# EAGLE design AVR_2x16_LCD_debug_ATmega48_board1 (EAGLE 6.5.0)
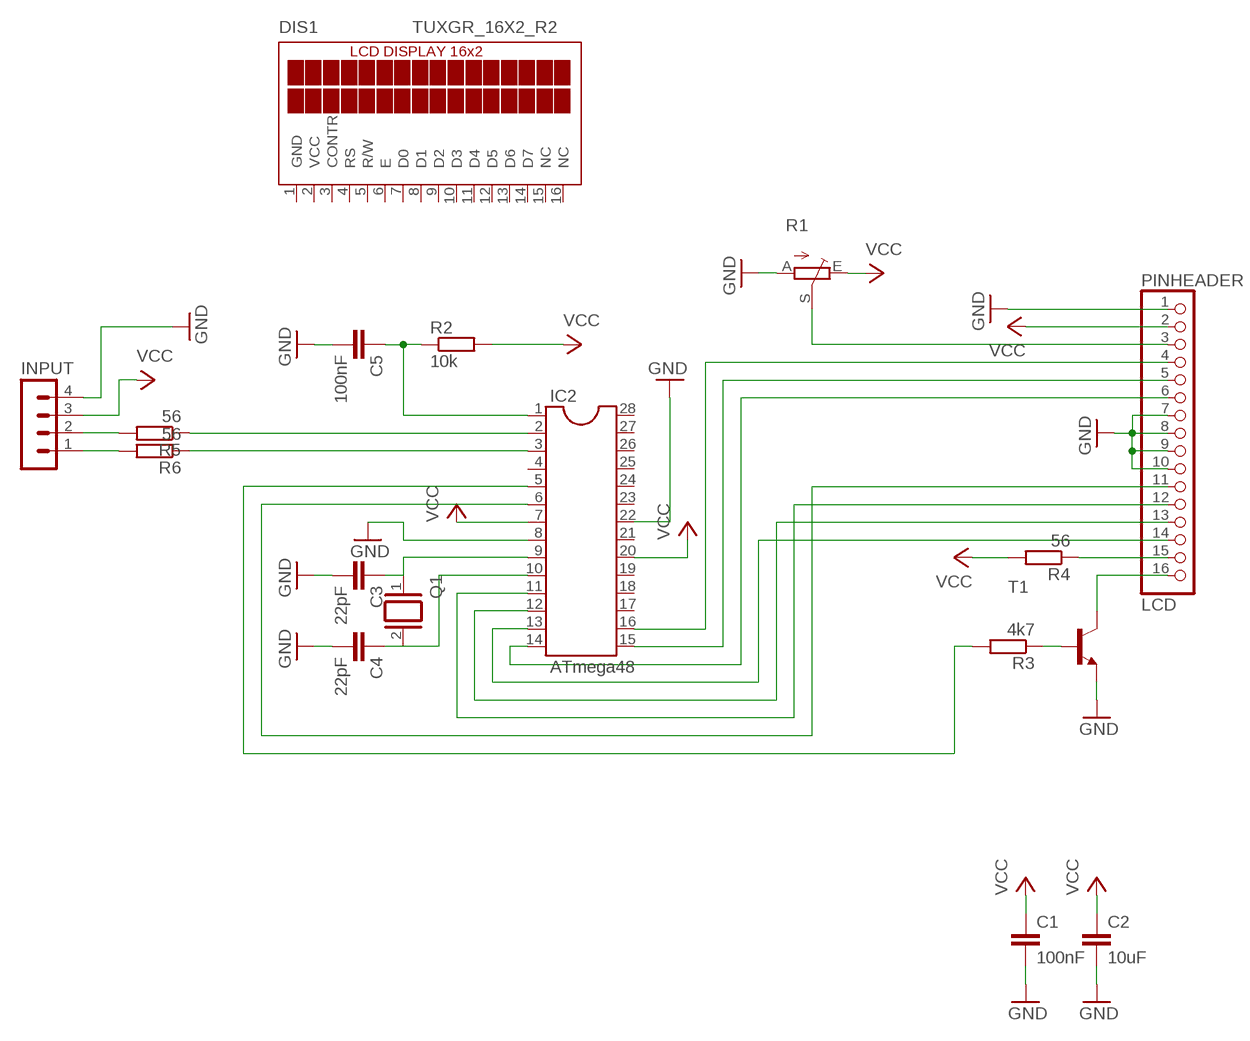
[diagram p0: schematic, sheet 1]

## Parts
C1  100nF  C5/2.5  [C5B2.5]
C2  10uF  C5/2.5  [C5B2.5]
C3  22pF  C5/2.5  [C5B2.5]
C4  22pF  C5/2.5  [C5B2.5]
C5  100nF  C5/2.5  [C5B2.5]
DIS1  TUXGR_16X2_R2  [TUXGR_16X2_R2]
IC2  ATmega48  DIL28-3  [DIL28-3]
INPUT  MA04-1  [MA04-1]
PINHEADER  LCD  PINHD-1X16  [1X16]
Q1  XTAL  [Q]
R1  TRIM_EU-CA6V  [CA6V]
R2  10k  R-EU_0204/5  [0204/5]
R3  4k7  R-EU_0204/5  [0204/5]
R4  56  R-EU_0204/5  [0204/5]
R5  56  R-EU_0204/5  [0204/5]
R6  56  R-EU_0204/5  [0204/5]
T1  -NPN-TO92  [TO92]

## Nets
GND: C1.2 C2.2 C3.2 C4.2 C5.2 IC2.8 IC2.22 INPUT.4 PINHEADER.1 PINHEADER.7 PINHEADER.8 PINHEADER.9 PINHEADER.10 R1.A T1.1(E)
N$1: PINHEADER.3 R1.S
N$2: C3.1 IC2.9 Q1.1
N$3: C4.1 IC2.10 Q1.2
N$4: IC2.2 R5.1
N$5: IC2.5 R3.2
N$6: IC2.3 R6.1
N$7: R3.1 T1.2(B)
N$8: PINHEADER.16 T1.3(C)
N$9: PINHEADER.15 R4.1
N$10: IC2.16 PINHEADER.4
N$11: IC2.15 PINHEADER.5
N$12: IC2.14 PINHEADER.6
N$13: IC2.13 PINHEADER.14
N$14: IC2.12 PINHEADER.13
N$15: IC2.11 PINHEADER.12
N$16: IC2.6 PINHEADER.11
RESET: C5.1 IC2.1 R2.1
RX: INPUT.2 R5.2
TX: INPUT.1 R6.2
VCC: C1.1 C2.1 IC2.7 IC2.20 INPUT.3 PINHEADER.2 R1.E R2.2 R4.2
Unconnected: DIS1.3(CONTR) DIS1.4(RS) DIS1.5(R/W) DIS1.6(E) DIS1.7(D0) DIS1.8(D1) DIS1.9(D2) DIS1.10(D3) DIS1.11(D4) DIS1.12(D5) DIS1.13(D6) DIS1.14(D7) DIS1.15(NC) DIS1.16(NC) IC2.4 IC2.17 IC2.18 IC2.19 IC2.21 IC2.23 IC2.24 IC2.25 IC2.26 IC2.27 IC2.28

## Power pins joined to a net without a drawn wire
GND: DIS1.1(GND)
VCC: DIS1.2(VCC)

## Library data of the parts
C1-C5 = capacitor-wima:C: CAPACITOR naming: grid - package width
DIS1 = display-lcd:TUXGR_16X2_R2: Tuxgraphics LCD display 16x2 characters reflective, without background light Source: tuxgr_12x2_r2.pdf; OC_FARNELL: unknown; OC_NEWARK: unknown
IC2 = ic-package:DIL28: Dual In Line
INPUT = con-lstb:MA04-1: PIN HEADER; OC_FARNELL: unknown; OC_NEWARK: unknown
PINHEADER = pinhead:PINHD-1X16: PIN HEADER
Q1 = special:XTAL: CRYSTAL
R1 = pot:TRIM_EU-: POTENTIOMETER
R2-R6 = rcl:R-EU_: RESISTOR, European symbol
T1 = transistor:*-NPN-: NPN Transistror BF959 corrected 2008.03.06

## Board
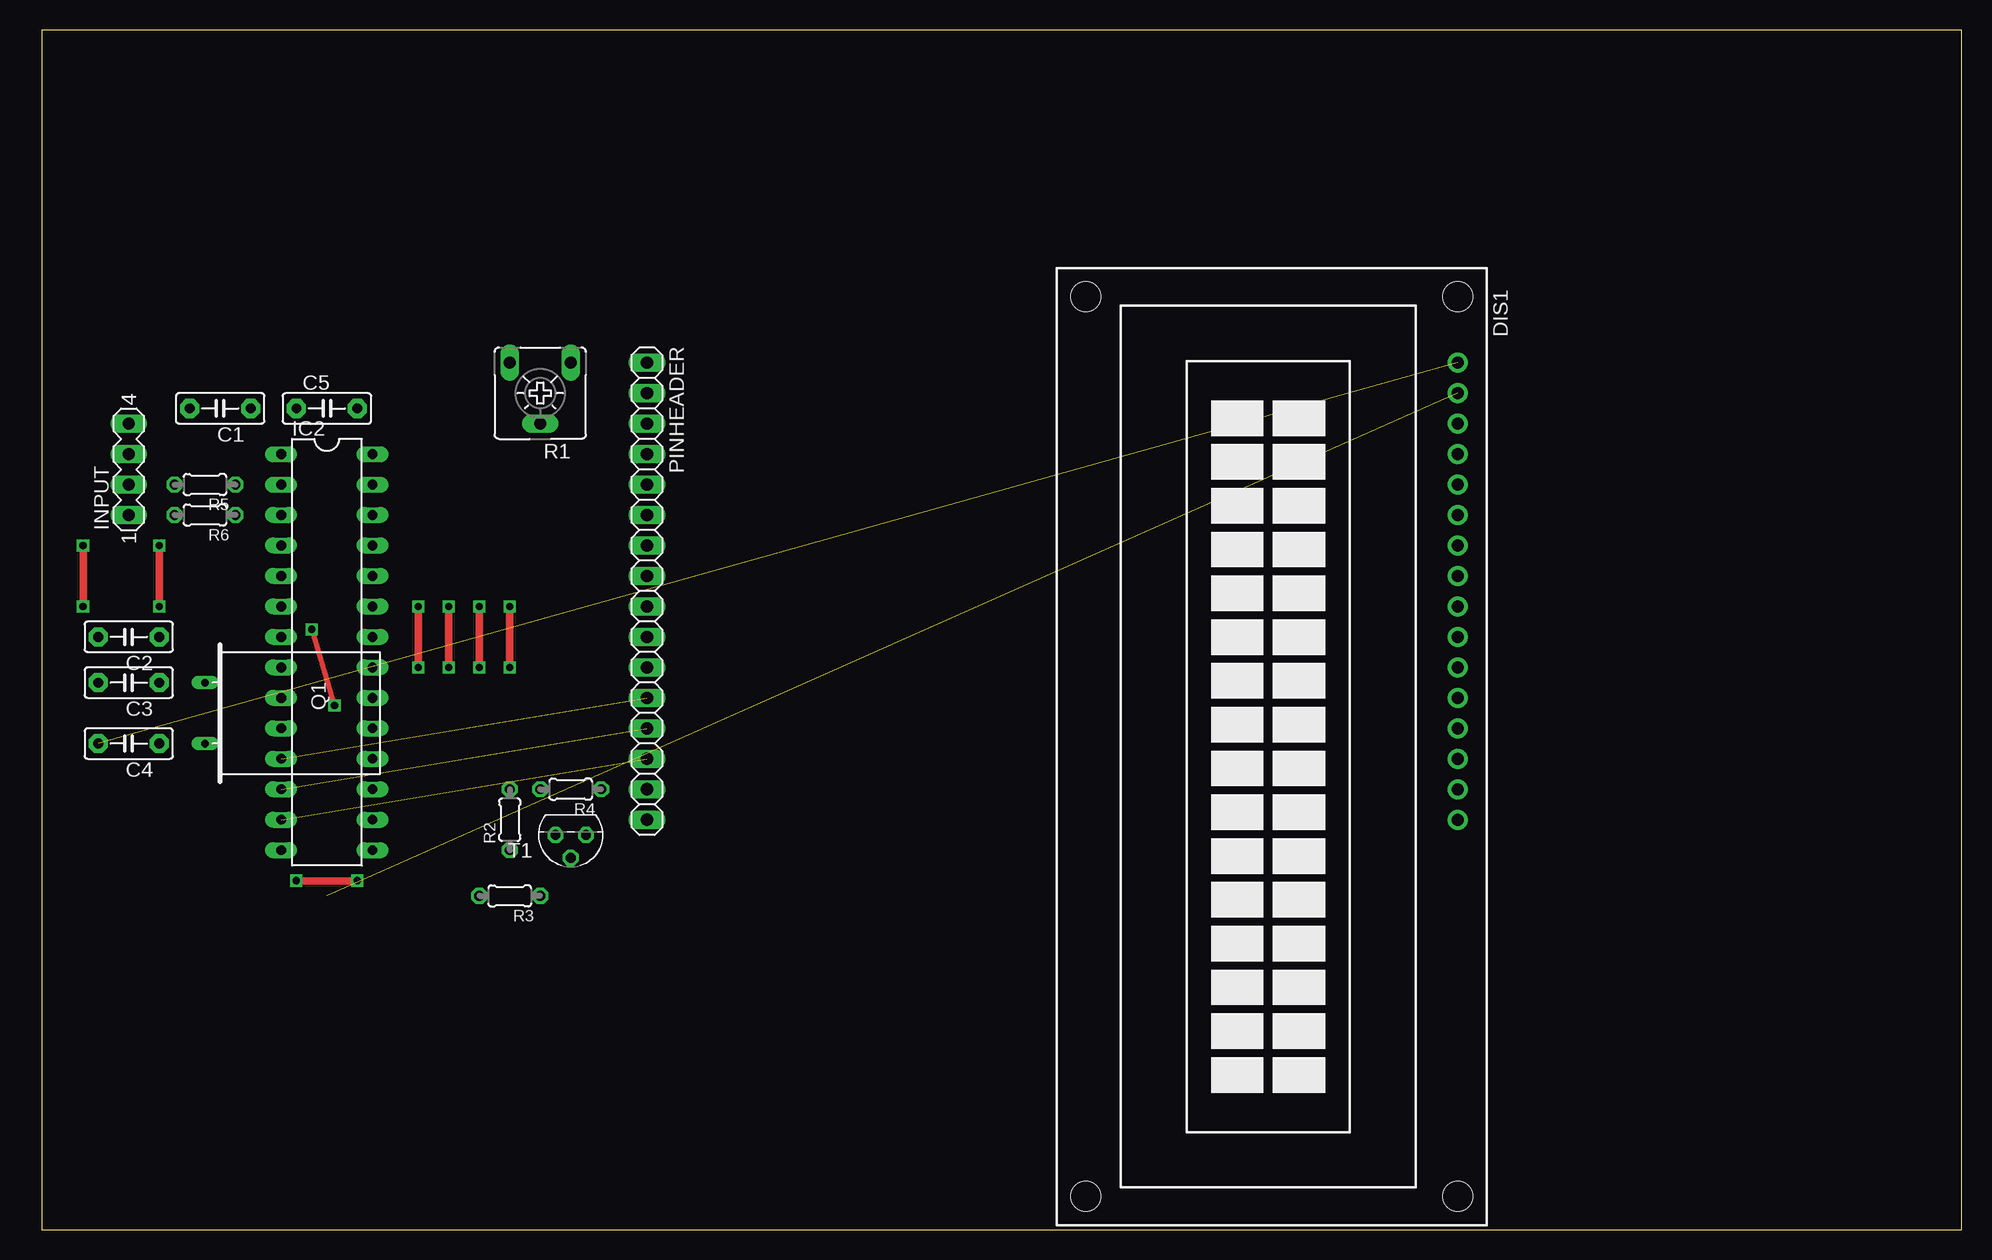
[diagram p1: board, top side]
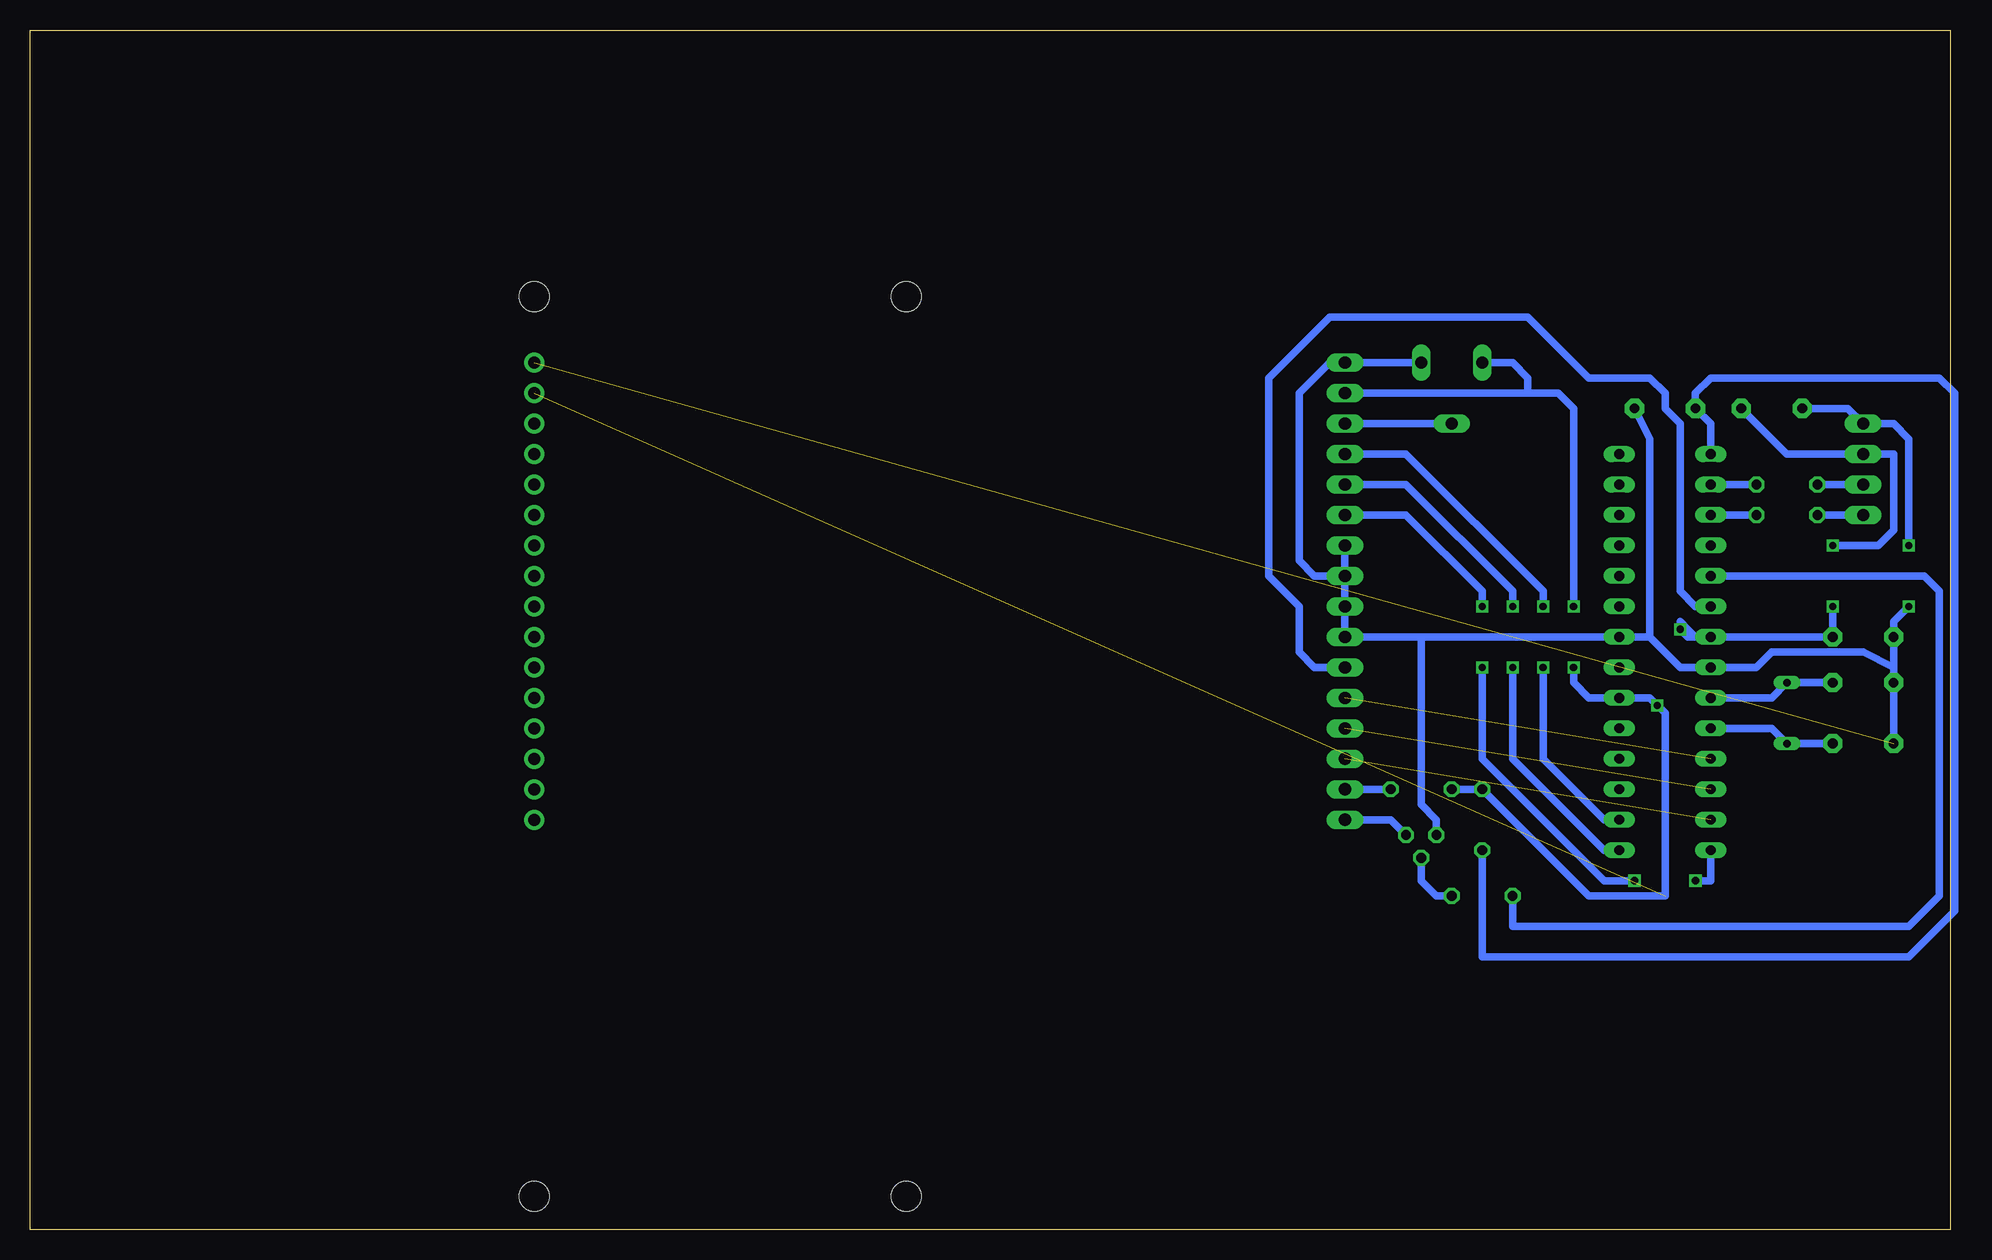
[diagram p2: board, bottom side, seen from below]

Size 160 x 100 mm. Coordinates in mm from the lower left corner, seen from the top.
Outline: 0,0 160,0 160,100 0,100 0,0
Copper layers (1*16): Top 0.035mm / dielectric 1.5mm / Bottom 0.035mm
Design rules "default": minimum track width 10mil, minimum drill 24mil, track to track 8mil, track to pad 8mil, pad to pad 8mil, via to via 8mil, smd to smd 8mil, copper to edge 40mil, drill to drill 8mil, minimum pad ring 10mil, minimum via ring 8mil, stop-mask expansion 4mil, vias tented up to drill 0mil, thermal gap 10mil

### Footprints (pad centres in the part's own frame; a part is rotated, then mirrored left to right if it is on the bottom)
C5B2.5 = drill 0.813 pad 1.6 octagon: 1 -2.54,0; 2 2.54,0
TUXGR_16X2_R2 = drill 1 pad 1.676: 1 -32,15.5; 2 -29.46,15.5; 3 -26.92,15.5; 4 -24.38,15.5; 5 -21.84,15.5; 6 -19.3,15.5; 7 -16.76,15.5; 8 -14.22,15.5; 9 -11.68,15.5; 10 -9.14,15.5; 11 -6.6,15.5; 12 -4.06,15.5; 13 -1.52,15.5; 14 1.02,15.5; 15 3.56,15.5; 16 6.1,15.5 | hole 2.5: -37.5,-15.5; 37.5,-15.5; -37.5,15.5; 37.5,15.5
DIL28-3 = drill 0.813 long: 1 -16.51,-3.81; 2 -13.97,-3.81; 3 -11.43,-3.81; 4 -8.89,-3.81; 5 -6.35,-3.81; 6 -3.81,-3.81; 7 -1.27,-3.81; 8 1.27,-3.81; 9 3.81,-3.81; 10 6.35,-3.81; 11 8.89,-3.81; 12 11.43,-3.81; 13 13.97,-3.81; 14 16.51,-3.81; 15 16.51,3.81; 16 13.97,3.81; 17 11.43,3.81; 18 8.89,3.81; 19 6.35,3.81; 20 3.81,3.81; 21 1.27,3.81; 22 -1.27,3.81; 23 -3.81,3.81; 24 -6.35,3.81; 25 -8.89,3.81; 26 -11.43,3.81; 27 -13.97,3.81; 28 -16.51,3.81
MA04-1 = drill 1.016 long: 1 -3.81,0; 2 -1.27,0; 3 1.27,0; 4 3.81,0
1X16 = drill 1.016 long: 1 -19.05,0; 2 -16.51,0; 3 -13.97,0; 4 -11.43,0; 5 -8.89,0; 6 -6.35,0; 7 -3.81,0; 8 -1.27,0; 9 1.27,0; 10 3.81,0; 11 6.35,0; 12 8.89,0; 13 11.43,0; 14 13.97,0; 15 16.51,0; 16 19.05,0
Q = drill 0.61 long: 1 -2.54,-7.62; 2 2.54,-7.62
CA6V = drill 1.016 long: A -2.54,-2.54; E 2.54,-2.54; S 0,2.54
0204/5 = drill 0.813 octagon: 1 -2.54,0; 2 2.54,0
TO92 = drill 0.813 octagon: 1 1.27,0; 2 0,1.905; 3 -1.27,0

### Placement (x,y rotation side)
C1  14.86,68.45 180 top
C2  7.24,49.4 180 top
C3  7.24,45.59 180 top
C4  7.24,40.51 180 top
C5  23.75,68.45 0 top
DIS1  102.49,40.26 270 top
IC2  23.75,48.13 270 top
INPUT  7.24,63.37 90 top
PINHEADER  50.42,53.21 270 top
Q1  21.21,43.05 270 top
R1  41.53,69.72 180 top
R2  38.99,34.16 90 top
R3  38.99,27.81 180 top
R4  44.07,36.7 180 top
R5  13.59,62.1 180 top
R6  13.59,59.56 180 top
T1  44.07,32.89 180 top

### Tracks (layer width: path | path; a pad name or v marks a point on that pad's centre or on a via)
GND  (via drill 0.6)  (1 unrouted)
  Top 0.61: v3.43,57.02 v3.43,51.94
  Bottom 0.61: 25.02,49.4 22.48,46.86 IC2.8 16.13,46.86 14.86,48.13 7.24,48.13 4.7,46.86 | 25.02,49.4 IC2.22 44.07,49.4 | 44.07,49.4 PINHEADER.10 PINHEADER.9 PINHEADER.8 | PINHEADER.8 PINHEADER.7 | C5.2 25.02,65.91 25.02,49.4 | C4.2 C3.2 4.7,46.86 | T1.1 42.8,34.16 44.07,35.43 44.07,49.4 | PINHEADER.8 52.96,54.48 54.23,55.75 54.23,69.72 51.69,72.26 PINHEADER.1 R1.A | v3.43,57.02 3.43,65.91 4.7,67.18 INPUT.4 8.51,68.45 C1.2 | v3.43,51.94 4.7,50.67 C2.2 4.7,46.86
N$1
  Bottom 0.61: R1.S PINHEADER.3
N$2
  Bottom 0.61: IC2.9 14.86,44.32 Q1.1 C3.1
N$3
  Bottom 0.61: IC2.10 14.86,41.78 Q1.2 C4.1
N$4
  Bottom 0.61: R5.1 IC2.2
N$5
  Bottom 0.61: R3.2 36.45,25.27 3.43,25.27 0.89,27.81 0.89,53.21 2.16,54.48 IC2.5
N$6
  Bottom 0.61: R6.1 IC2.3
N$7
  Bottom 0.61: R3.1 42.8,27.81 44.07,29.08 T1.2
N$8
  Bottom 0.61: T1.3 46.61,34.16 PINHEADER.16
N$9
  Bottom 0.61: R4.1 PINHEADER.15
N$10  (via drill 0.6)
  Top 0.61: v33.91,46.86 v33.91,51.94
  Bottom 0.61: IC2.16 28.83,34.16 33.91,39.24 v33.91,46.86 | v33.91,51.94 33.91,53.21 45.34,64.64 PINHEADER.4
N$11  (via drill 0.6)
  Top 0.61: v36.45,51.94 v36.45,46.86
  Bottom 0.61: PINHEADER.5 45.34,62.1 36.45,53.21 v36.45,51.94 | v36.45,46.86 36.45,39.24 28.83,31.62 IC2.15
N$12  (via drill 0.6)
  Top 0.61: v21.21,29.08 v26.29,29.08 | v38.99,46.86 v38.99,51.94
  Bottom 0.61: IC2.14 19.94,29.08 v21.21,29.08 | v26.29,29.08 28.83,29.08 38.99,39.24 v38.99,46.86 | v38.99,51.94 38.99,53.21 45.34,59.56 PINHEADER.6
N$13  (1 unrouted)
N$14  (1 unrouted)
N$15  (1 unrouted)
N$16
  Bottom 0.61: IC2.6 21.21,51.94 22.48,53.21 22.48,67.18 23.75,68.45 23.75,69.72 25.02,70.99 30.1,70.99 35.18,76.07 51.69,76.07 56.77,70.99 56.77,54.48 54.23,51.94 54.23,48.13 52.96,46.86 PINHEADER.11
RESET
  Bottom 0.61: IC2.1 19.94,67.18 C5.1 21.21,69.72 19.94,70.99 0.89,70.99 -0.38,69.72 -0.38,26.54 3.43,22.73 38.99,22.73 R2.1
RX
  Bottom 0.61: INPUT.2 R5.2
TX
  Bottom 0.61: R6.2 INPUT.1
VCC  (via drill 0.6)  (1 unrouted)
  Top 0.406: v22.48,50.04 v24.38,43.69
  Top 0.61: v31.37,46.86 v31.37,51.94 | v9.78,57.02 v9.78,51.94
  Bottom 0.61: R4.2 R2.2 30.1,27.81 23.75,27.81 23.75,43.05 v24.38,43.69 25.02,44.32 IC2.20 30.1,44.32 31.37,45.59 v31.37,46.86 | v31.37,51.94 31.37,68.45 32.64,69.72 35.18,69.72 | 35.18,69.72 PINHEADER.2 | v9.78,57.02 5.97,57.02 4.7,58.29 4.7,64.64 INPUT.3 13.59,64.64 C1.1 | v9.78,51.94 C2.1 IC2.7 21.21,49.4 | R1.E 36.45,72.26 35.18,70.99 35.18,69.72 | 21.84,50.04 22.48,50.67 v22.48,50.04 | v22.48,50.04 21.84,50.04 | 21.84,50.04 21.21,49.4 | 21.21,49.4 21.84,49.4 v22.48,50.04